# EAGLE design TempSensorCircuit_v2 (EAGLE 9.2.1)

## Sheet 1 of 2
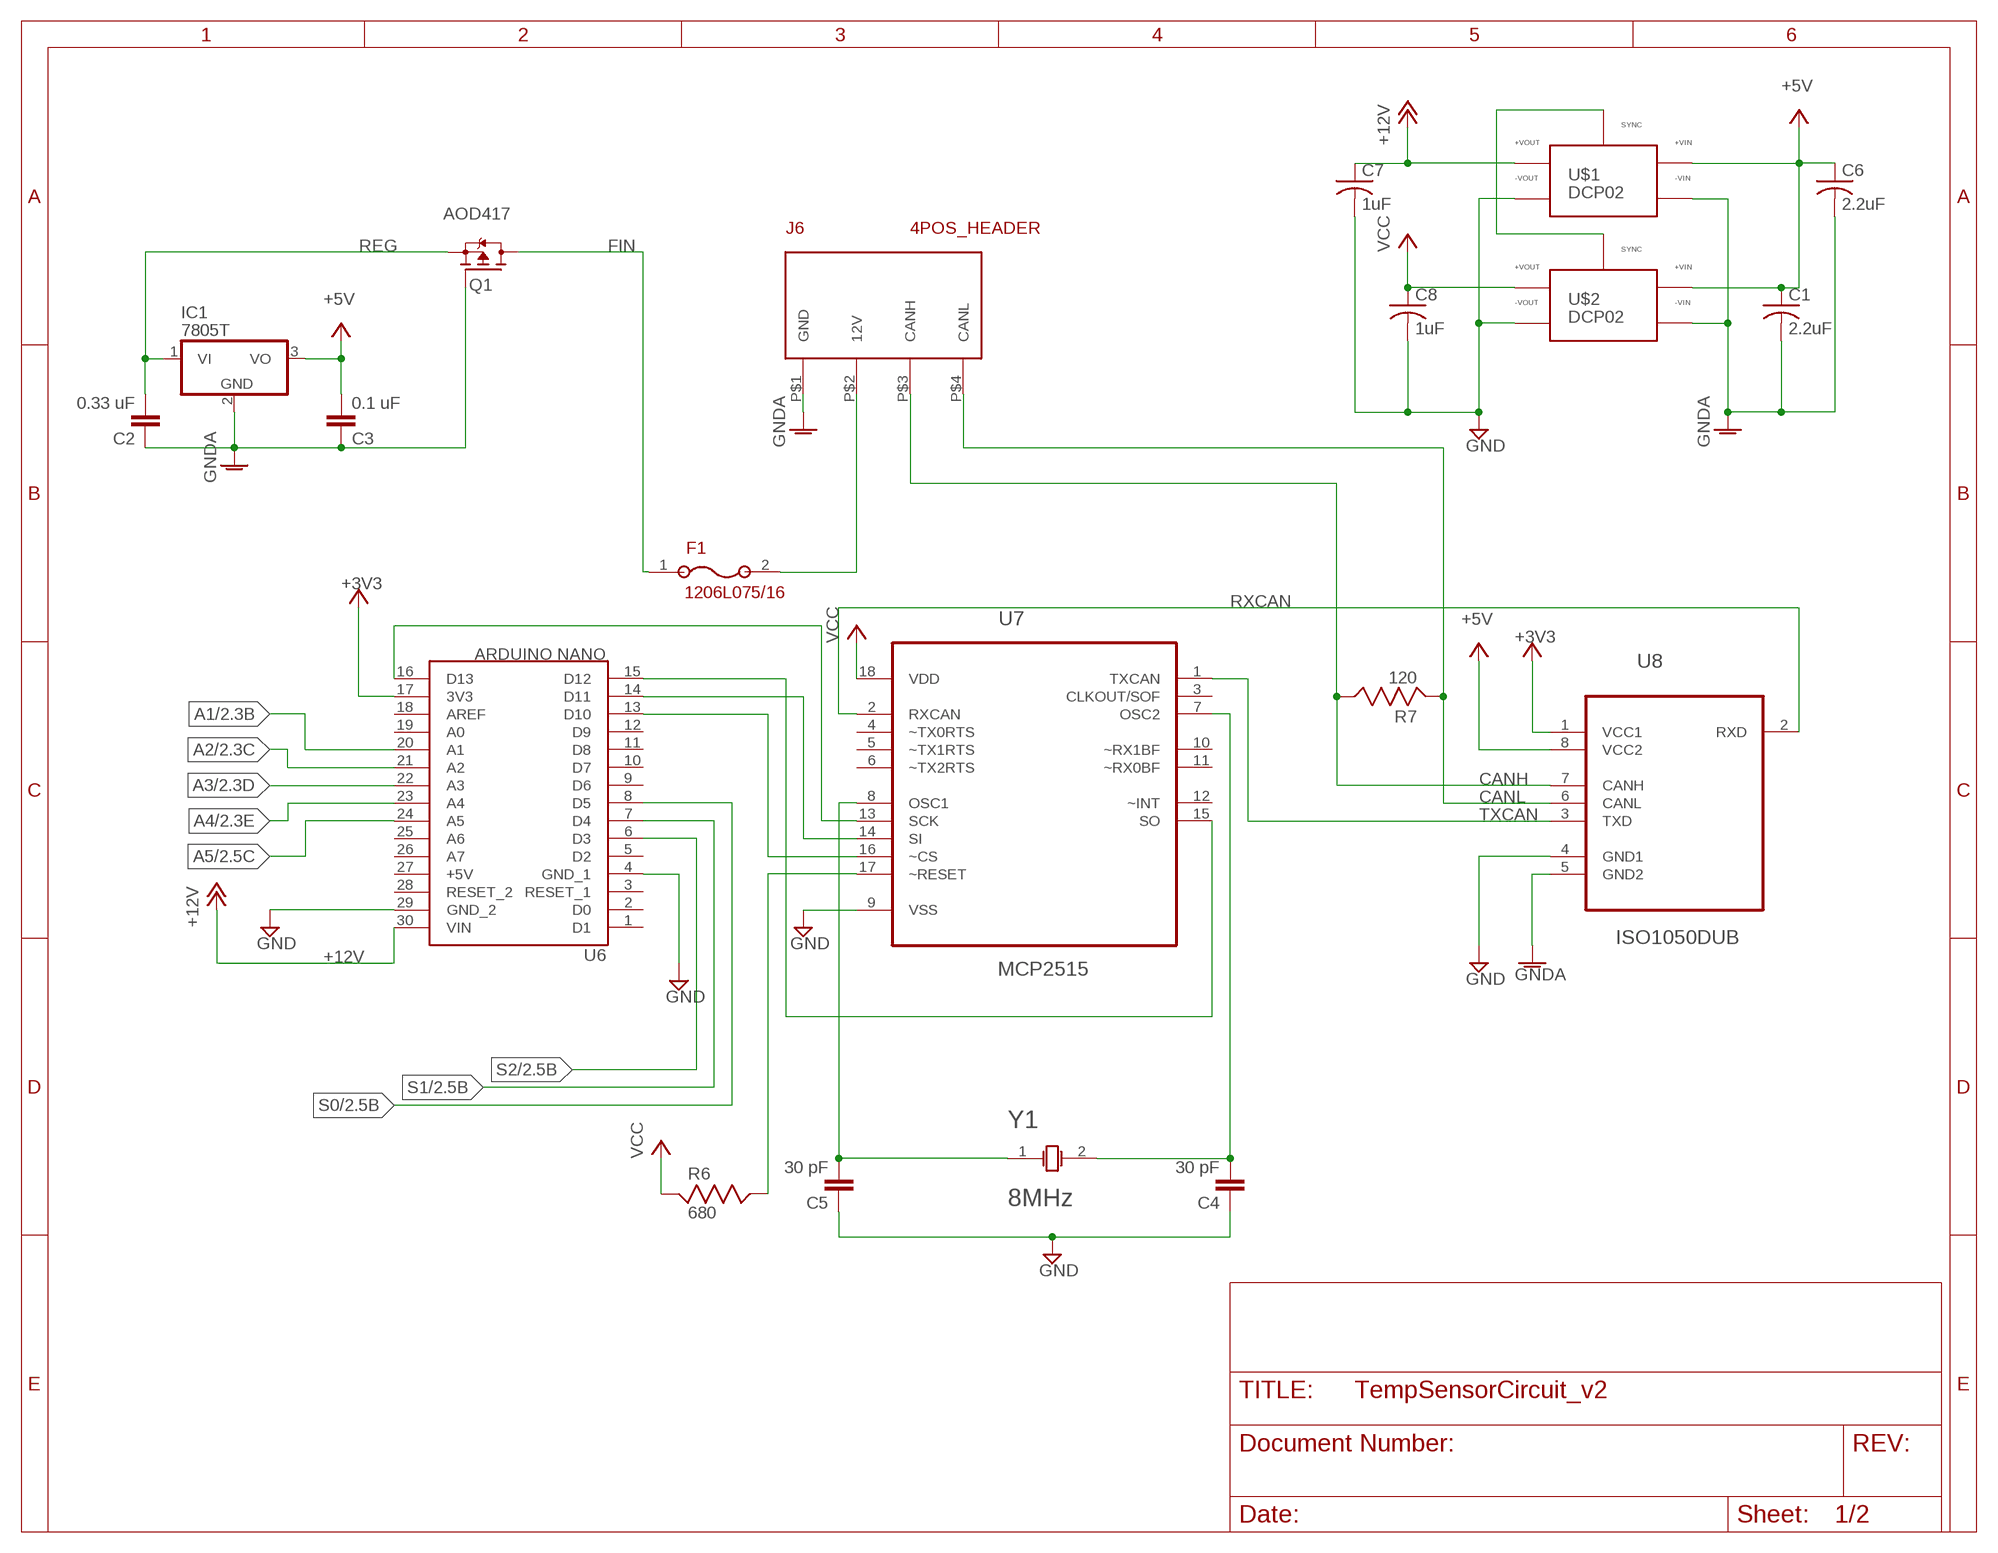
[diagram p0: schematic, sheet 1]

### Parts
C1  2.2uF  C-USC0805  [C0805]
C2  0.33 uF  C5/2.5  [C5B2.5]
C3  0.1 uF  C5/2.5  [C5B2.5]
C4  30 pF  C5/2.5  [C5B2.5]
C5  30 pF  C5/2.5  [C5B2.5]
C6  2.2uF  C-USC0805  [C0805]
C7  1uF  C-USC0805  [C0805]
C8  1uF  C-USC0805  [C0805]
F1  1206L075/16  [1206L075/16]
IC1  7805T  [TO220H]
J6  4POS_HEADER  [4POS_HEADER]
Q1  AOD417  FDD4141TO252  [TO252]
R6  680  RC0805FR-0751K1L  [RESC2012X60]
R7  120  RC0805FR-0751K1L  [RESC2012X60]
U6  ARDUINO NANO  NANO  [NANO]
U7  MCP2515  MCP2515-I/P  [DIP254P762X432-18]
U8  ISO1050DUB  [SOP254P1040X485-8N]
U$1  DCP02  [DIL14]
U$2  DCP02  [DIL14]
Y1  8MHz  HC49/SLF  [XTAL_HC49P488W43L1135T465H360]

### Nets
+3V3: U6.17(3V3) U8.1(VCC1)
+5V: C1.1 C3.2 C6.1 IC1.3(VO) U8.8(VCC2) U$1.1(+VIN) U$2.1(+VIN)
+12V: C7.1 U6.30(VIN) U$1.6(+VOUT)
A1: U6.20(A1) ; also sheet 2
A2: U6.21(A2) ; also sheet 2
A3: U6.22(A3) ; also sheet 2
A4: U6.23(A4) ; also sheet 2
A5: U6.24(A5) ; also sheet 2
CANH: J6.P$3(CANH) R7.2 U8.7(CANH)
CANL: J6.P$4(CANL) R7.1 U8.6(CANL)
FIN: F1.1 Q1.3(D)
GND: C4.1 C5.1 C7.2 C8.2 U6.4(GND_1) U6.29(GND_2) U7.9(VSS) U8.4(GND1) U$1.5(-VOUT) U$2.5(-VOUT) ; also sheet 2
GNDA: C1.2 C2.1 C3.1 C6.2 IC1.2(GND) J6.P$1(GND) Q1.1(G) U8.5(GND2) U$1.2(-VIN) U$2.2(-VIN)
N$1: R6.2 U7.17(~RESET)
N$3: U6.16(D13) U7.13(SCK)
N$7: U6.14(D11) U7.14(SI)
N$8: U6.15(D12) U7.15(SO)
N$9: U6.13(D10) U7.16(~CS)
N$10: U$1.14(SYNC) U$2.14(SYNC)
N$18: F1.2 J6.P$2(12V)
OSC_N [DiffPair]: C5.2 U7.8(OSC1) Y1.1
OSC_P [DiffPair]: C4.2 U7.7(OSC2) Y1.2
REG: C2.2 IC1.1(VI) Q1.2(S)
RXCAN: U7.2(RXCAN) U8.2(RXD)
S0: U6.8(D5) ; also sheet 2
S1: U6.7(D4) ; also sheet 2
S2: U6.6(D3) ; also sheet 2
TXCAN: U7.1(TXCAN) U8.3(TXD)
VCC: C8.1 R6.1 U7.18(VDD) U$2.6(+VOUT) ; also sheet 2
Unconnected: U6.1(D1) U6.2(D0) U6.3(RESET_1) U6.5(D2) U6.9(D6) U6.10(D7) U6.11(D8) U6.12(D9) U6.18(AREF) U6.19(A0) U6.25(A6) U6.26(A7) U6.28(RESET_2) U7.3(CLKOUT/SOF) U7.4(~TX0RTS) U7.5(~TX1RTS) U7.6(~TX2RTS) U7.10(~RX1BF) U7.11(~RX0BF) U7.12(~INT)

## Sheet 2 of 2
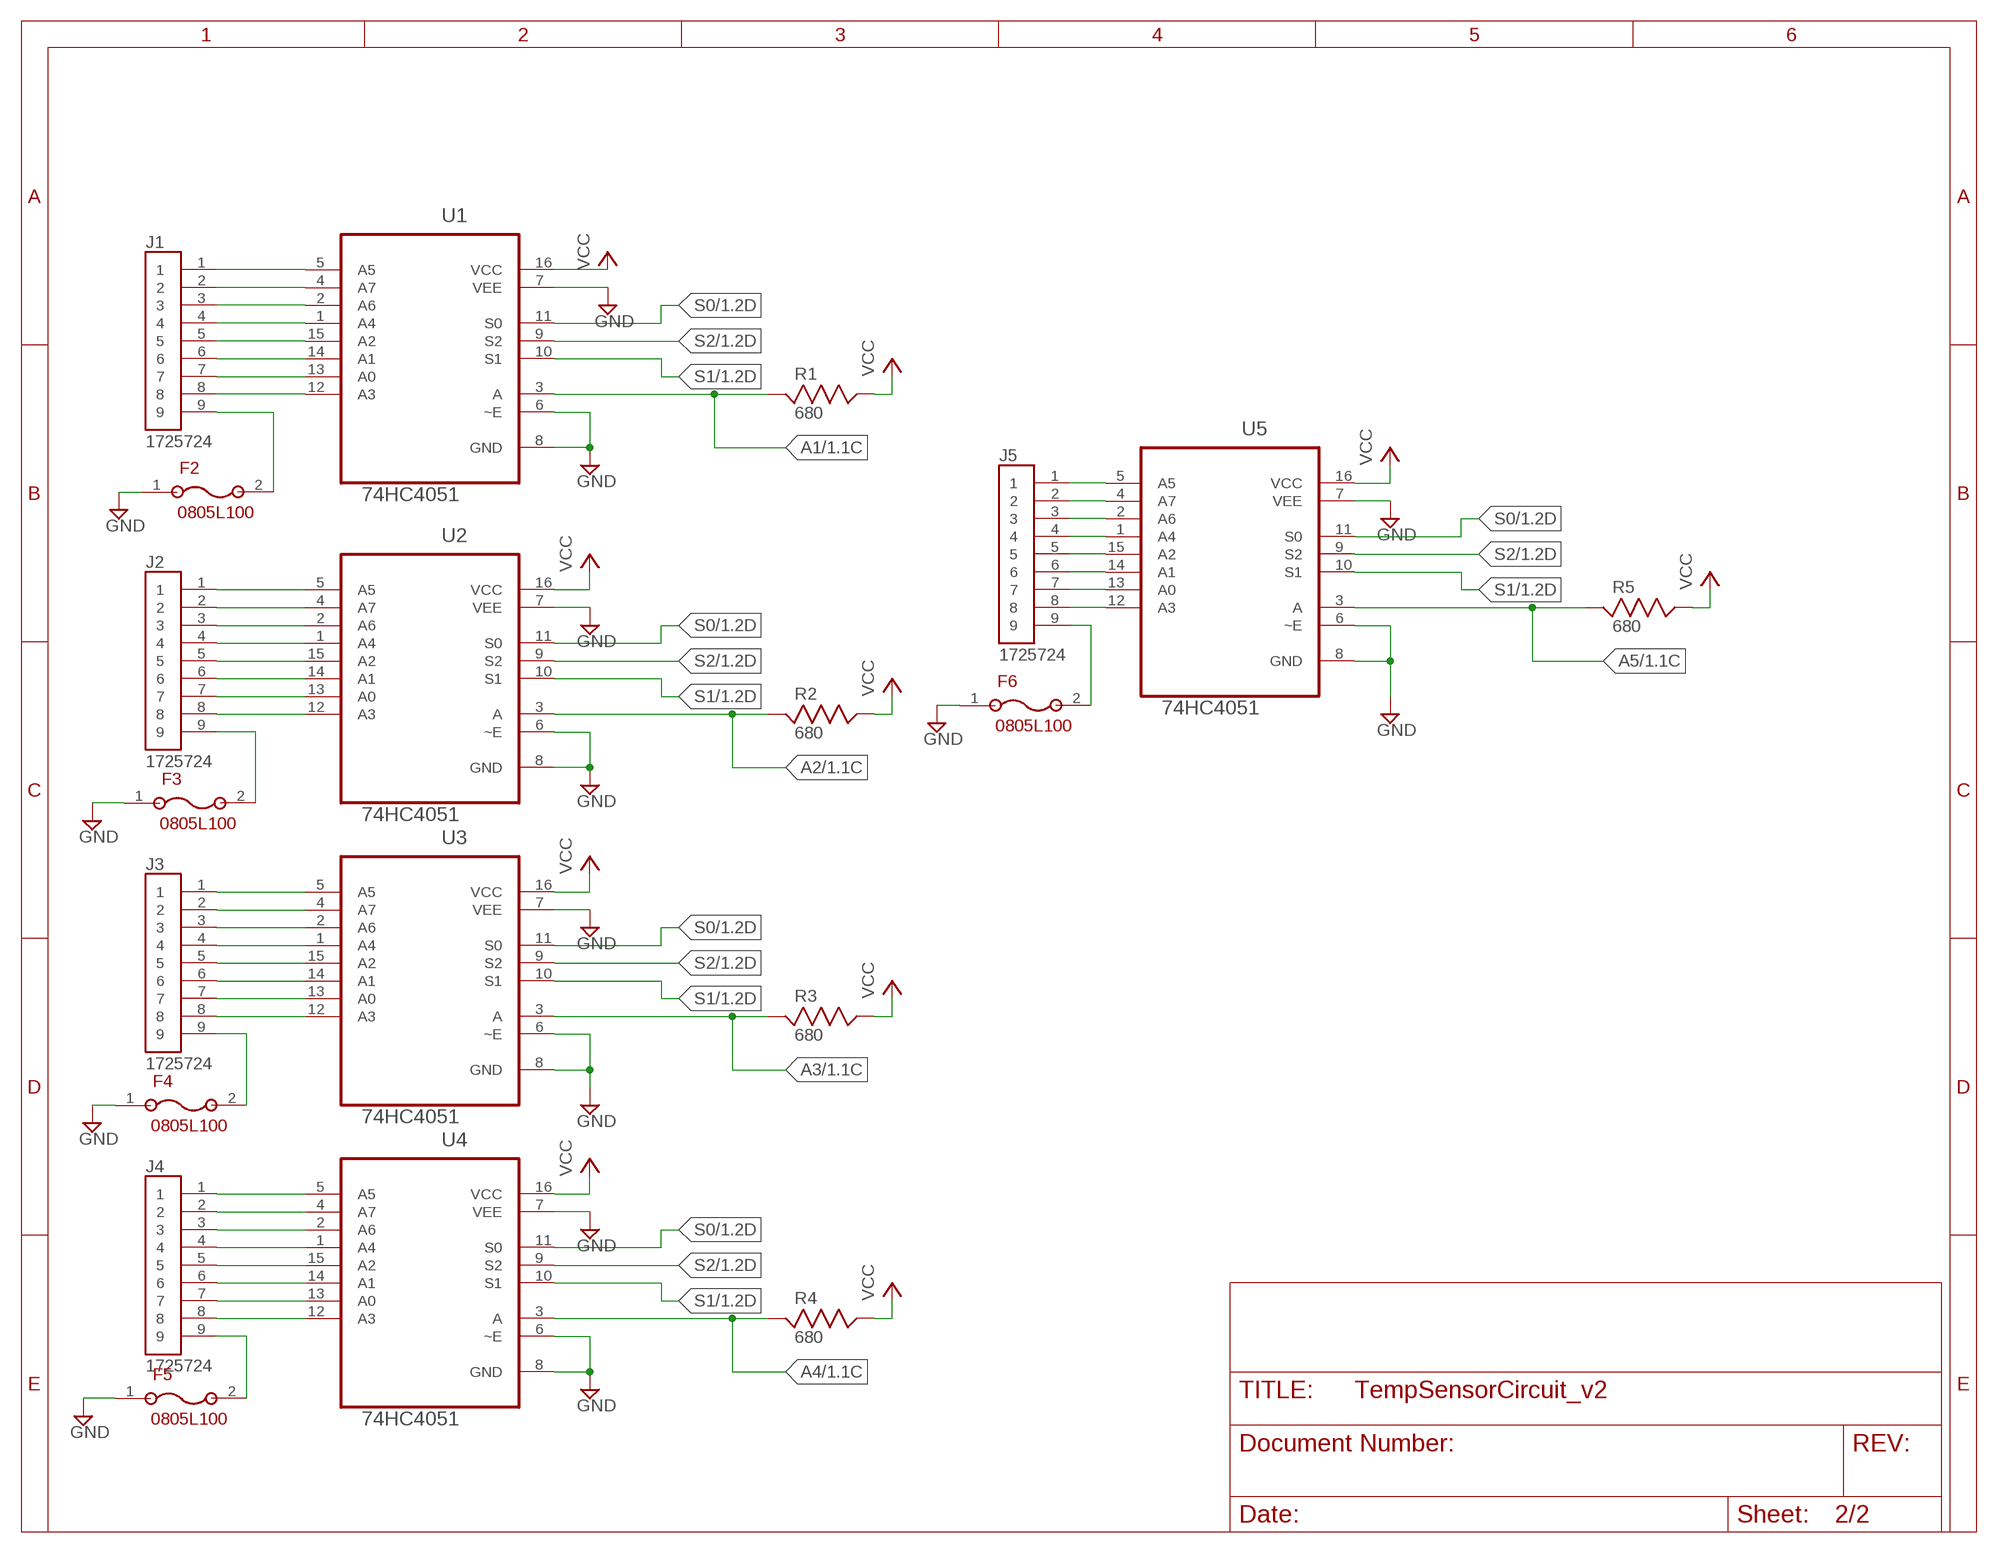
[diagram p1: schematic, sheet 2]

### Parts
F2  0805L100  [2012]
F3  0805L100  [2012]
F4  0805L100  [2012]
F5  0805L100  [2012]
F6  0805L100  [2012]
J1  1725724  [HDRV9W90P254_9X1_2332X620X850]
J2  1725724  [HDRV9W90P254_9X1_2332X620X850]
J3  1725724  [HDRV9W90P254_9X1_2332X620X850]
J4  1725724  [HDRV9W90P254_9X1_2332X620X850]
J5  1725724  [HDRV9W90P254_9X1_2332X620X850]
R1  680  RC0805FR-0751K1L  [RESC2012X60]
R2  680  RC0805FR-0751K1L  [RESC2012X60]
R3  680  RC0805FR-0751K1L  [RESC2012X60]
R4  680  RC0805FR-0751K1L  [RESC2012X60]
R5  680  RC0805FR-0751K1L  [RESC2012X60]
U1  74HC4051  CD74HC4051E  [DIP254P762X508-16]
U2  74HC4051  CD74HC4051E  [DIP254P762X508-16]
U3  74HC4051  CD74HC4051E  [DIP254P762X508-16]
U4  74HC4051  CD74HC4051E  [DIP254P762X508-16]
U5  74HC4051  CD74HC4051E  [DIP254P762X508-16]

### Nets
A1: R1.1 U1.3(A) ; also sheet 1
A2: R2.1 U2.3(A) ; also sheet 1
A3: R3.1 U3.3(A) ; also sheet 1
A4: R4.1 U4.3(A) ; also sheet 1
A5: R5.1 U5.3(A) ; also sheet 1
GND: F2.1 F3.1 F4.1 F5.1 F6.1 U1.6(~E) U1.7(VEE) U1.8(GND) U2.6(~E) U2.7(VEE) U2.8(GND) U3.6(~E) U3.7(VEE) U3.8(GND) U4.6(~E) U4.7(VEE) U4.8(GND) U5.6(~E) U5.7(VEE) U5.8(GND) ; also sheet 1
N$2: J3.1 U3.5(A5)
N$4: J3.2 U3.4(A7)
N$5: J1.8 U1.12(A3)
N$6: J3.3 U3.2(A6)
N$13: J3.4 U3.1(A4)
N$14: J3.5 U3.15(A2)
N$15: J3.6 U3.14(A1)
N$17: J3.7 U3.13(A0)
N$19: J1.7 U1.13(A0)
N$20: J1.6 U1.14(A1)
N$21: J1.5 U1.15(A2)
N$22: J1.4 U1.1(A4)
N$23: J1.3 U1.2(A6)
N$25: J1.2 U1.4(A7)
N$26: J1.1 U1.5(A5)
N$27: J3.8 U3.12(A3)
N$28: J2.1 U2.5(A5)
N$29: J2.2 U2.4(A7)
N$30: J2.3 U2.2(A6)
N$31: J2.4 U2.1(A4)
N$32: J2.5 U2.15(A2)
N$33: J2.6 U2.14(A1)
N$34: J2.7 U2.13(A0)
N$35: J2.8 U2.12(A3)
N$36: J4.1 U4.5(A5)
N$37: J4.2 U4.4(A7)
N$38: J4.3 U4.2(A6)
N$39: J4.4 U4.1(A4)
N$40: J4.5 U4.15(A2)
N$41: J4.6 U4.14(A1)
N$42: J4.7 U4.13(A0)
N$43: J4.8 U4.12(A3)
N$45: F2.2 J1.9
N$46: F5.2 J4.9
N$47: F4.2 J3.9
N$48: F3.2 J2.9
N$49: F6.2 J5.9
N$51: J5.1 U5.5(A5)
N$52: J5.2 U5.4(A7)
N$53: J5.3 U5.2(A6)
N$54: J5.4 U5.1(A4)
N$55: J5.5 U5.15(A2)
N$56: J5.6 U5.14(A1)
N$57: J5.7 U5.13(A0)
N$58: J5.8 U5.12(A3)
S0: U1.11(S0) U2.11(S0) U3.11(S0) U4.11(S0) U5.11(S0) ; also sheet 1
S1: U1.10(S1) U2.10(S1) U3.10(S1) U4.10(S1) U5.10(S1) ; also sheet 1
S2: U1.9(S2) U2.9(S2) U3.9(S2) U4.9(S2) U5.9(S2) ; also sheet 1
VCC: R1.2 R2.2 R3.2 R4.2 R5.2 U1.16(VCC) U2.16(VCC) U3.16(VCC) U4.16(VCC) U5.16(VCC) ; also sheet 1

## Power pins joined to a net without a drawn wire
+5V: U6.27(+5V)

## Library data of the parts
C1 C6-C8 = rcl:C-US: CAPACITOR, American symbol; SPICEPREFIX: C
C2-C5 = capacitor-wima:C: CAPACITOR naming: grid - package width
F1 = 1206L:1206L075/16
F2-F6 = 0805L:0805L100
IC1 = linear:78*: Positive VOLTAGE REGULATOR Source: http://cache.national.com/ds/LM/LM78L05.pdf http://www.fairchildsemi.com/ds/LM/LM7805.pdf
J1-J5 = 1725724:1725724: Conn; Term Blk; PCB; 9; 2.54mm; Front; Screw; 26-20 AWG; 6A; 63V; Solder; 1.5kV; DESCRIPTION: Conn; Term Blk; PCB; 9; 2.54mm; Front; Screw; 26-20 AWG; 6A; 63V; Solder; 1.5kV; DIGI-KEY_PART_NUMBER: 277-1280-ND; DIGI-KEY_PURCHASE_URL: https://www.digikey.ca/product-detail/en/phoenix-contact/1725724/277-1280-ND/267469?utm_source=snapeda&utm_medium=aggregator&utm_campaign=symbol; MF: Phoenix Contact; MP: 1725724; PACKAGE: None
J6 = 4Pos_Header:4POS_HEADER
Q1 = AOD417:FDD4141: P-Channel PowerTrench® MOSFET Source: FDD4141.pdf; AVAILABILITY: Unavailable; DESCRIPTION: Transistor: P-MOSFET; unipolar; -40V; -50A; 69W; DPAK; MF: ON Semiconductor; MP: FDD4141; PACKAGE: TO-252-3 Fairchild Semiconductor; PRICE: None
R1-R7 = RC0805FR-0751K1L:RC0805FR-0751K1L: RC Series 0805 0.125 W 2 kOhms 5% ±100 ppm/°C SMT Thick Film Chip Resistor; AVAILABILITY: Unavailable; DESCRIPTION: Res Thick Film 2.0 x 1.2 mm 51.1K Ohm 1% 0.125W_1/8W_ 100ppm/ C Molded SMD Paper T/R; MF: Yageo; MP: RC0805FR-0751K1L; PACKAGE: 0805 Yageo; PRICE: None
U1-U5 = CD74HC4051E:CD74HC4051E: HIGH-SPEED CMOS LOGIC ANALOG MULTIPLEXERS/DEMULTIPLEXERS; AVAILABILITY: Unavailable; DESCRIPTION: High Speed CMOS 8-Channel Analog Multiplexer/Demultiplexer 16-PDIP -55 to 125; MF: Texas Instruments; MP: CD74HC4051E; PACKAGE: PDIP-16 Texas Instruments; PRICE: None
U6 = ArduinoNano:NANO: MICRO, ARDUINO NANO 3.0, MINI-B USB, ATmega328, 0.1"DIP, ICSP HDR; AVAILABILITY: Unavailable; DESCRIPTION: MICRO, ARDUINO NANO 3.0, MINI-B USB, ATmega328, 0.1DIP, ICSP HDR; MF: Arduino; MP: A000005; PACKAGE: None; PRICE: None
U7 = MCP2515-I_P:MCP2515-I/P: Stand-Alone CAN Controller; AVAILABILITY: Unavailable; DESCRIPTION: MCP2515 Series 5.5 V 1 Mb/s Stand Alone SPI Interface CAN Controller - PDIP-18; MF: Microchip; MP: MCP2515-I/P; PACKAGE: DIP-18 Microchip; PRICE: None
U8 = ISO1050DUB:ISO1050DUB: ISOLATED CAN TRANSCEIVER; AVAILABILITY: Unavailable; DESCRIPTION: Isolated 5-V CAN Transceivers 8-SOP -55 to 105; MF: Texas Instruments; MP: ISO1050DUB; PACKAGE: SOP-8 Texas Instruments; PRICE: None
U$1 U$2 = ISO1050DUB:DCP02
Y1 = XTAL_HC49P488W43L1135T465H360:HC49/SLF

## Net classes
0 default: width 0.5 mm, clearance 0.2 mm
1 DiffPair: width 0.305 mm, clearance 0.2 mm

## Board
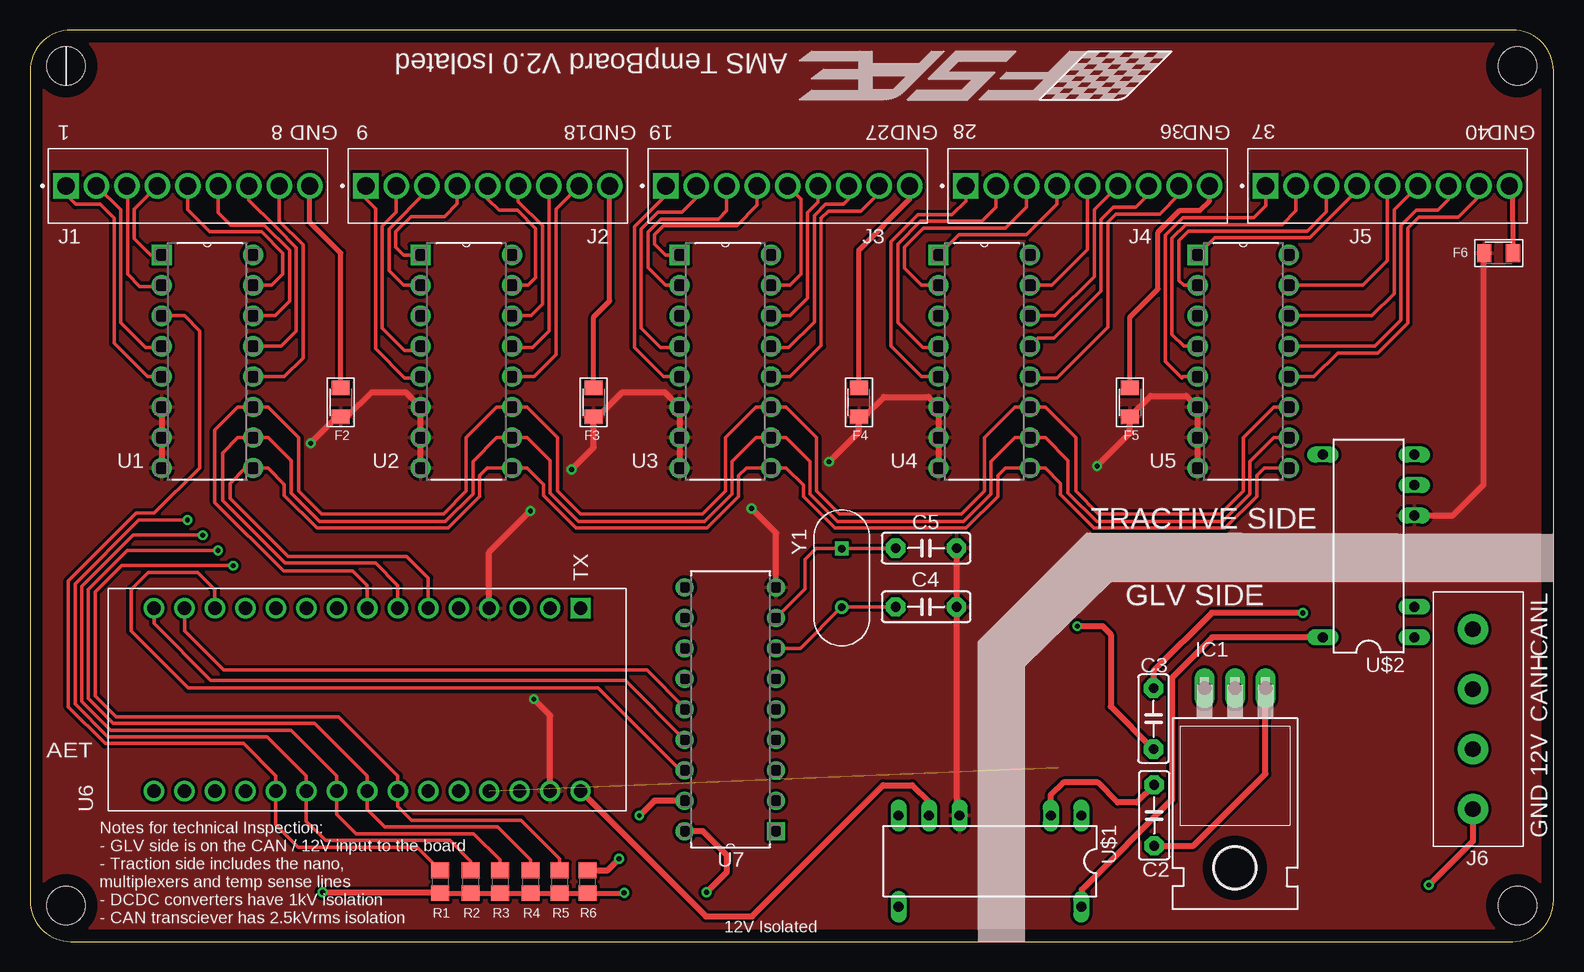
[diagram p2: board, top side]
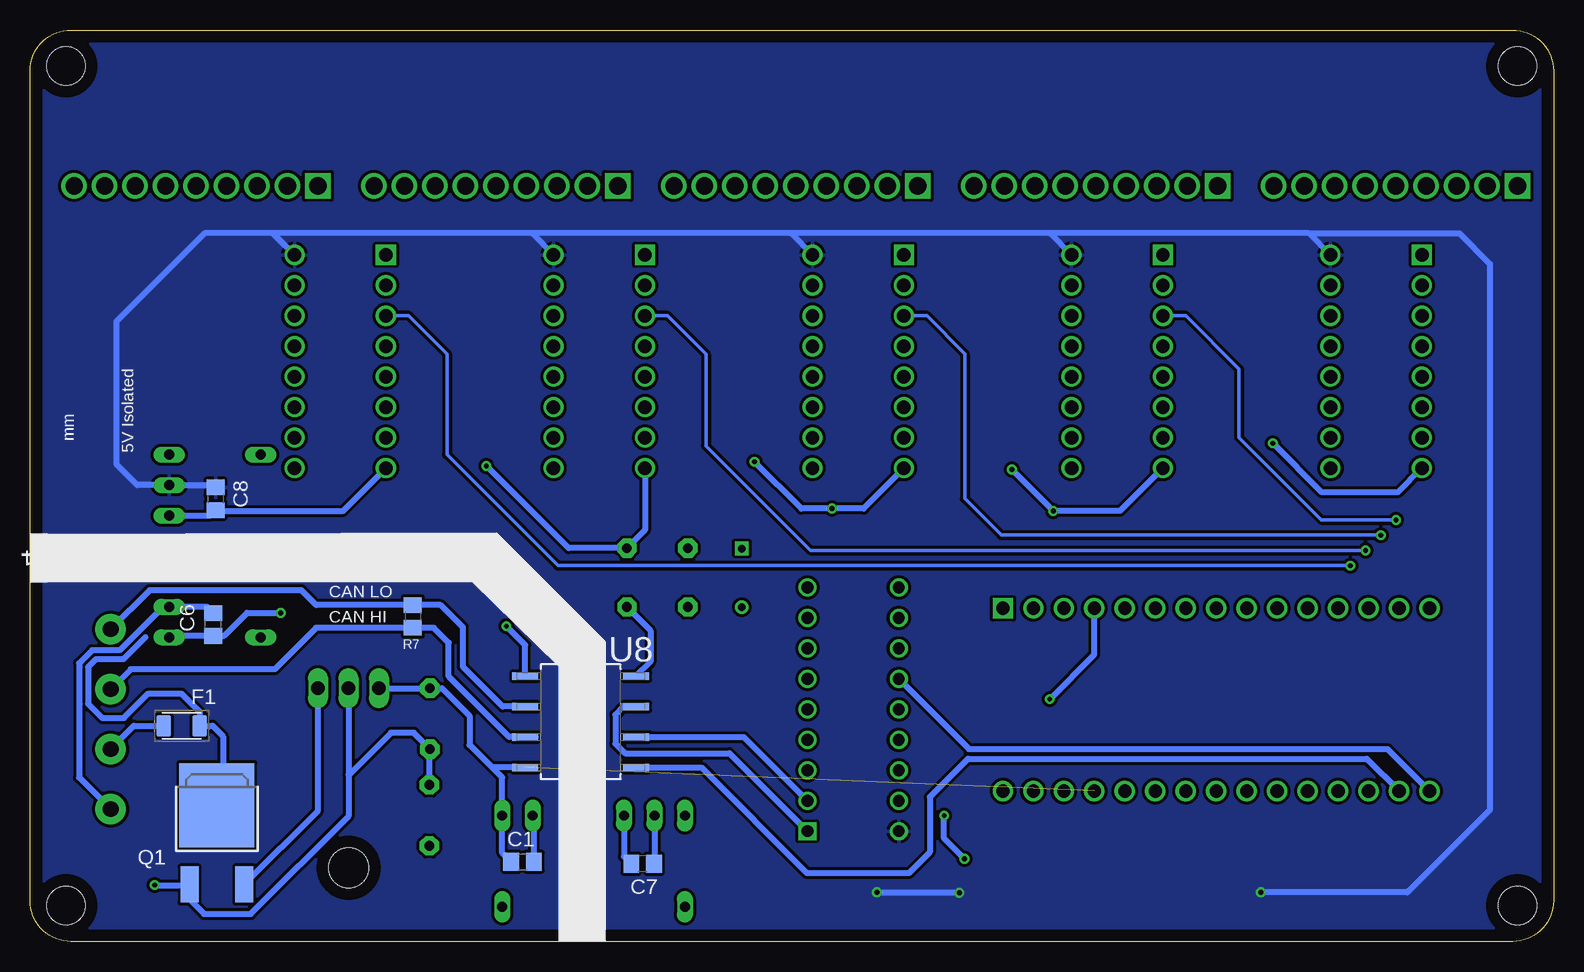
[diagram p3: board, bottom side, seen from below]

Size 127 x 76 mm. Coordinates in mm from the lower left corner, seen from the top.
Outline: 0,72.59 0,3.41 arc90 3.41,0 123.59,0 arc90 127,3.41 127,72.59 arc90 123.59,76 3.41,76 arc90 0,72.59
Copper layers (1*16): Top 0.035mm / dielectric 2mm / Bottom 0.035mm
Design rules "default *": minimum track width 6mil, minimum drill 0.4mm, track to track 10mil, track to pad 10mil, pad to pad 10mil, via to via 10mil, smd to smd 6mil, copper to edge 40mil, drill to drill 6mil, minimum pad ring 10mil, minimum via ring 8mil, stop-mask expansion 4mil, vias tented up to drill 0mil, thermal gap 10mil
Holes 3.17 mm at 3,73 124,73 124,3 3,3

### Footprints (pad centres in the part's own frame; a part is rotated, then mirrored left to right if it is on the bottom)
C0805 = smd 1.3 x 1.5: 1 -0.95,0; 2 0.95,0
C5B2.5 = drill 0.813 pad 1.6 octagon: 1 -2.54,0; 2 2.54,0
1206L075/16 = smd 1.2 x 1.82: 1 -1.505,0; 2 1.505,0
2012 = smd 1.2 x 1.5: 1 -1.2,0; 2 1.2,0
TO220H = drill 1.118 long: 1 -2.54,-10.16; 2 0,-10.16; 3 2.54,-10.16 | hole 3.302: 0,4.826
HDRV9W90P254_9X1_2332X620X850 = drill 1.42 square: 1 0,0 | drill 1.42: 2 2.54,0; 3 5.08,0; 4 7.62,0; 5 10.16,0; 6 12.7,0; 7 15.24,0; 8 17.78,0; 9 20.32,0
4POS_HEADER = drill 1.3 pad 2.54: P$1 -7.5,0.45; P$2 -2.5,0.45; P$3 2.5,0.45; P$4 7.5,0.45
TO252 = smd 1.5 x 3: 1 -2.286,-6.6; 2 2.28,-6.6 | smd 6.25 x 7: 3 0,0
RESC2012X60 = smd 1.3 x 1.5: 1 -0.95,0; 2 0.95,0
DIP254P762X508-16 = drill 1.118 square: 1 -7.62,17.78 | drill 1.118: 2 -7.62,15.24; 3 -7.62,12.7; 4 -7.62,10.16; 5 -7.62,7.62; 6 -7.62,5.08; 7 -7.62,2.54; 8 -7.62,0; 9 0,0; 10 0,2.54; 11 0,5.08; 12 0,7.62; 13 0,10.16; 14 0,12.7; 15 0,15.24; 16 0,17.78
NANO = drill 1.1 pad 1.7 square: 1 -7.62,17.78 | drill 1.1 pad 1.7: 2 -7.62,15.24; 3 -7.62,12.7; 4 -7.62,10.16; 5 -7.62,7.62; 6 -7.62,5.08; 7 -7.62,2.54; 8 -7.62,0; 9 -7.62,-2.54; 10 -7.62,-5.08; 11 -7.62,-7.62; 12 -7.62,-10.16; 13 -7.62,-12.7; 14 -7.62,-15.24; 15 -7.62,-17.78; 16 7.62,-17.78; 17 7.62,-15.24; 18 7.62,-12.7; 19 7.62,-10.16; 20 7.62,-7.62; 21 7.62,-5.08; 22 7.62,-2.54; 23 7.62,0; 24 7.62,2.54; 25 7.62,5.08; 26 7.62,7.62; 27 7.62,10.16; 28 7.62,12.7; 29 7.62,15.24; 30 7.62,17.78
DIP254P762X432-18 = drill 0.991 square: 1 -7.62,20.32 | drill 0.991: 2 -7.62,17.78; 3 -7.62,15.24; 4 -7.62,12.7; 5 -7.62,10.16; 6 -7.62,7.62; 7 -7.62,5.08; 8 -7.62,2.54; 9 -7.62,0; 10 0,0; 11 0,2.54; 12 0,5.08; 13 0,7.62; 14 0,10.16; 15 0,12.7; 16 0,15.24; 17 0,17.78; 18 0,20.32
SOP254P1040X485-8N = smd 2.159 x 0.61: 1 -4.623,3.81; 2 -4.623,1.27; 3 -4.623,-1.27; 4 -4.623,-3.81; 5 4.623,-3.81; 6 4.623,-1.27; 7 4.623,1.27; 8 4.623,3.81
DIL14 = drill 0.813 long: 1 -7.62,-3.81; 2 -5.08,-3.81; 5 2.54,-3.81; 6 5.08,-3.81; 7 7.62,-3.81; 8 7.62,3.81; 14 -7.62,3.81
XTAL_HC49P488W43L1135T465H360 = drill 0.63 pad 1.03 square: 1 -2.44,0 | drill 0.63 pad 1.03: 2 2.44,0

### Placement (x,y rotation side)
C1  85.95,6.65 0 bottom
C2  93.71,10.52 270 top
C3  93.66,18.58 90 top
C4  74.7,27.9 180 top
C5  74.7,32.8 180 top
C6  111.73,26.43 90 bottom
C7  75.93,6.49 180 bottom
C8  111.54,36.92 270 bottom
F1  114.35,17.98 180 bottom
F2  25.91,44.96 90 top
F3  46.99,44.96 90 top
F4  69.09,44.96 90 top
F5  91.69,44.96 90 top
F6  122.43,57.4 0 top
IC1  100.45,10.97 180 top
J1  3,63 0 top
J2  28,63 0 top
J3  53,63 0 top
J4  78,63 0 top
J5  103,63 0 top
J6  120.72,18.55 90 top
Q1  111.42,11.36 0 bottom
R1  34.2,4.98 270 top
R2  36.73,4.98 270 top
R3  39.17,4.98 270 top
R4  41.72,4.98 270 top
R5  44.16,4.98 270 top
R6  46.49,4.98 90 top
R7  95.09,27.1 270 bottom
U1  18.59,39.47 0 top
U2  40.18,39.47 0 top
U3  61.77,39.47 0 top
U4  83.36,39.47 0 top
U5  104.95,39.47 0 top
U6  28.11,20.16 270 top
U7  54.58,29.52 180 top
U8  81.1,18.32 180 bottom
U$1  80.02,6.7 180 top
U$2  111.58,32.98 90 top
Y1  67.66,30.32 270 top

### Tracks (layer width: path | path; a pad name or v marks a point on that pad's centre or on a via)
+3V3
  Bottom 0.5: U6.17 15.58,15.25 48.8,15.25 52,12.05 52,7.45 53.75,5.7 62.23,5.7 71.04,14.51 U8.1
+5V  (via drill 0.4)  (1 unrouted)
  Top 0.5: v106.1,27.4 98.51,27.4 93.66,22.55 C3.2
  Bottom 0.5: IC1.3 97.9,21.12 C3.2 92.66,21.12 90.36,18.82 90.36,16.39 88.48,14.51 | U8.8 88.48,14.51 | C1.1 87.64,7.39 U$1.1 87.64,13.67 88.48,14.51 | U$2.1 115.27,25.48 C6.1 110.82,25.48 108.9,27.4 v106.1,27.4
+12V
  Top 0.5: U6.30 56.34,2.1 60.19,2.1 71.12,13.03 73.54,13.03 74.94,11.63 U$1.6
  Bottom 0.5: U$1.6 74.94,6.53 C7.1
A1
  Top 0.305: U1.3 12.88,52.17 14.14,50.9 14.14,39.5 10.36,35.71 8.85,35.71 3.19,30.06 3.19,19.57 6.26,16.51 17.8,16.51 20.5,13.81 U6.20 20.5,9.73 22.35,7.87 32.27,7.87 34.2,5.95 R1.1
A2  (via drill 0.4)
  Top 0.305: v13.13,35.15 9.08,35.15 3.75,29.82 3.75,19.8 6.49,17.07 19.78,17.07 23.04,13.81 U6.21 23.04,10.04 24.64,8.43 35,8.43 36.73,6.7 R2.1
  Bottom 0.305: U2.3 30.66,52.17 26.21,47.72 26.21,42.01 19.35,35.15 v13.13,35.15
A3  (via drill 0.4)
  Top 0.305: v14.4,33.88 8.6,33.88 4.31,29.59 4.31,20.03 6.72,17.62 21.77,17.62 25.57,13.81 U6.22 25.57,10.6 27.18,8.99 36.98,8.99 39.17,6.8 R3.1
  Bottom 0.305: U3.3 52.24,52.17 49.07,48.99 49.07,36.93 46.02,33.88 v14.4,33.88
A4  (via drill 0.4)
  Top 0.305: v15.67,32.61 8.12,32.61 4.87,29.36 4.87,20.26 6.95,18.18 23.75,18.18 28.11,13.81 U6.23 28.11,11 29.57,9.55 38.96,9.55 41.72,6.8 R4.1
  Bottom 0.305: U4.3 73.83,52.17 70.66,48.99 70.66,41.33 61.94,32.61 v15.67,32.61
A5  (via drill 0.4)
  Top 0.305: v16.94,31.34 7.64,31.34 5.43,29.13 5.43,20.49 7.18,18.74 25.73,18.74 30.66,13.81 U6.24 30.66,11.26 31.8,10.11 40.95,10.11 44.16,6.9 R5.1
  Bottom 0.305: U5.3 95.42,52.17 92.25,48.99 92.25,40.6 82.99,31.34 v16.94,31.34
CANH
  Bottom 0.5: 84.85,17.05 U8.7 87.05,17.05 92.1,22.1 92.1,24.9 93.35,26.15 R7.2 103.15,26.15 106.6,22.7 118.62,22.7 J6.P$3
CANL
  Bottom 0.5: U8.6 87.59,19.59 90.9,22.9 90.9,26.2 92.75,28.05 R7.1 103.13,28.05 104.36,29.29 117.03,29.29 J6.P$4
FIN
  Bottom 0.5: 109.84,11.36 Q1.3 110.9,11.88 110.9,17.1 111.78,17.98 F1.1 112.85,19.14 114.39,20.68 117.13,20.68 119.18,18.63 120.96,18.63 122.15,19.82 122.15,22.89 121.51,23.52 119.22,23.52 117.39,25.36
GND  (via drill 0.4)
  Top 0.5: U1.6 U1.7 U1.8 | U2.8 U2.7 U2.6 31.31,45.8 28.5,45.8 26.46,43.76 F2.1 25.61,43.76 v23.4,41.55 | U4.8 U4.7 U4.6 74.89,45.4 71.18,45.4 69.54,43.76 F4.1 69.09,42.49 v66.6,40 | U3.8 U3.7 U3.6 52.9,45.8 49.38,45.8 47.34,43.76 F3.1 46.99,41.19 v45.15,39.35 | U5.8 U5.7 U5.6 96.38,45.5 93.44,45.5 F5.1 91.69,42.39 v88.95,39.65 | F6.1 121.17,57.35 121.17,38.1 118.59,35.52 U$2.5 | U7.9 62.2,34.05 v60.15,36.1 | U6.29 43.35,18.84 v42,20.2 | U6.4 38.27,32.48 v41.7,35.9 | C5.1 C4.1 77.24,10.75 U$1.5
  Bottom 0.5: U1.8 12.99,37.45 19.3,37.45 v23.4,41.55 | U2.8 36.13,35.9 v41.7,35.9 v45.15,39.35 | U3.8 57.52,36.1 v60.15,36.1 62.7,36.1 v66.6,40 | U4.8 75.74,34.3 C5.1 82.1,32.8 v88.95,39.65 | v42,20.2 38.27,23.93 U6.4 | U8.4 75.28,23.33 75.28,25.93 C4.1 | U5.8 100.94,35.86 111.43,35.86 C8.2 111.99,35.52 U$2.5 | U$1.5 77.48,7.09 C7.2
  pour Top: -6.4,81.08 137.77,81.08 137.77,31.7 137.77,-7.62 43.89,-7.62 -6.4,-7.62
GNDA  (via drill 0.4)
  Top 0.5: v87.3,26.3 89.4,26.3 90.1,25.6 90.1,19.6 C3.1 | J6.P$1 120.27,8.37 v116.6,4.7 | C2.1 92.25,11.6 90.66,11.6 89,13.26 86.13,13.26 85.08,12.21 85.08,10.53 U$1.2
  Bottom 0.2: C6.2 112.25,27.9 | U$2.2 115.91,27.9
  Bottom 0.5: IC1.2 100.45,13.9 | 100.45,13.9 100.45,10.45 108.6,2.3 112.5,2.3 113.7,3.5 Q1.1 113.77,4.7 v116.6,4.7 | C2.1 93.71,15.99 C3.1 95.02,17.4 96.9,17.4 100.4,13.9 100.45,13.9 | J6.P$1 122.9,13.68 122.9,23.2 121.82,24.28 119.54,24.28 115.91,27.9 | U8.5 85.72,24.72 v87.3,26.3 | C1.2 85,10.41 U$1.2 | C6.2 112.11,27.76 | 112.25,27.9 U$2.2
N$1  (via drill 0.4)
  Top 0.5: U7.17 52.05,11.74 v50.8,10.5 | R6.2 48.13,5.93 v49.1,6.9
  Bottom 0.5: v49.1,6.9 50.8,8.6 v50.8,10.5
N$2
  Top 0.305: U3.5 52.83,47.09 50.39,49.53 50.39,59.62 53,62.23 J3.1
N$3
  Bottom 0.5: U7.13 48.73,16.05 13.85,16.05 U6.16
N$4
  Top 0.305: U3.4 54.05,49.53 52.58,49.53 50.95,51.16 50.95,59.39 52.37,60.81 54.36,60.81 55.54,61.99 J3.2
N$5
  Top 0.305: U1.12 21.18,47.09 22.76,48.67 22.76,58.1 20.78,60.08 J1.8
N$6
  Top 0.305: U3.2 52.99,54.71 51.51,56.19 51.51,59.16 52.6,60.25 57.4,60.25 58.08,60.92 J3.3
N$7
  Top 0.305: U6.14 12.88,25.88 16.13,22.63 51.44,22.63 54.58,19.49 U7.14
N$8
  Top 0.305: U6.15 10.34,26.52 15.08,21.77 49.64,21.77 U7.15
N$9
  Top 0.305: U6.13 15.41,29.36 13.99,30.78 9.85,30.78 8.43,29.36 8.43,25.88 13.18,21.14 47.37,21.14 54.22,14.29 U7.16
N$10
  Top 0.5: U$2.14 98.56,25.36 95.2,22 95.2,11.85 87.67,4.32 87.67,2.92
N$13
  Top 0.305: U3.1 52.99,57.25 52.07,58.17 52.07,58.93 52.83,59.69 58.93,59.69 60.62,61.38 J3.4
N$14
  Top 0.305: U3.15 63.34,54.71 64.26,55.63 64.26,61.9 J3.5
N$15
  Top 0.305: U3.14 63.34,52.17 64.82,53.65 64.82,60.76 65.7,61.64 J3.6
N$17
  Top 0.305: U3.13 61.87,49.53 63.25,49.53 65.38,51.66 65.38,60.52 66.32,61.47 67.82,61.47 68.24,61.89 J3.7
N$18
  Bottom 0.5: J6.P$2 118.34,17.98 F1.2
N$19
  Top 0.305: U1.13 20.93,49.63 22.2,50.9 22.2,57.15 22.2,57.87 20.6,59.46 20.48,59.59 18.24,61.83 J1.7
N$20
  Top 0.305: U1.14 20.42,52.17 21.64,53.39 21.64,57.63 19.54,59.74 16.71,59.74 15.7,60.75 J1.6
N$21
  Top 0.305: U1.15 20.16,54.71 21.08,55.63 21.08,57.4 19.3,59.18 14.99,59.18 13.16,61.01 J1.5
N$22
  Top 0.305: U1.1 10.06,57.25 8.69,58.62 8.69,61.07 J1.4
N$23
  Top 0.305: U1.2 10.87,54.61 9.14,54.61 8.13,55.63 8.13,62.95 J1.3
N$25
  Top 0.305: U1.4 10.87,49.53 9.65,49.53 7.57,51.61 7.57,61.01 5.58,63 J1.2
N$26
  Top 0.305: U1.5 9.81,47.09 7.01,49.89 7.01,60.3 5.84,61.47 3.81,61.47 3,62.28 J1.1
N$27
  Top 0.305: U3.12 63.34,47.09 65.94,49.68 65.94,60.29 66.55,60.91 69.29,60.91 70.78,62.4 J3.8
N$28
  Top 0.305: U2.5 32.46,46.99 31.24,46.99 28.8,49.43 28.8,61.11 28,61.92 J2.1
N$29
  Top 0.305: U2.4 32.21,49.28 31.24,49.28 29.36,51.16 29.36,59.65 30.54,60.82 J2.2
N$30
  Top 0.305: U2.2 31.14,54.71 29.92,55.93 29.92,59.41 33.08,62.57 J2.3
N$31
  Top 0.305: U2.1 31.14,57.25 30.48,57.91 30.48,59.18 31.75,60.45 34.54,60.45 35.62,61.53 J2.4
N$32
  Top 0.305: U2.15 41.5,54.71 42.16,55.37 42.16,59.44 40.64,60.96 39.12,60.96 38.16,61.92 J2.5
N$33
  Top 0.305: U2.14 41.76,52.17 42.72,53.14 42.72,59.67 40.7,61.69 J2.6
N$34
  Top 0.305: U2.13 40.28,49.53 41.91,49.53 43.28,50.9 43.28,62.96 J2.7
N$35
  Top 0.305: U2.12 42.01,47.09 43.84,48.92 43.84,61.06 J2.8
N$36
  Top 0.305: U4.5 74.32,47.09 71.78,49.63 71.78,58.38 74.01,60.6 76.86,60.6 78,61.74 J4.1
N$37
  Top 0.305: U4.4 75.64,49.53 74.42,49.53 72.34,51.61 72.34,58.14 74.24,60.05 79.35,60.05 80.54,61.24 J4.2
N$38
  Top 0.305: U4.2 74.32,54.71 73.36,55.68 72.9,56.13 72.9,57.91 74.47,59.49 81.33,59.49 83.08,61.24 J4.3
N$39
  Top 0.305: U4.1 77.42,58.93 83.06,58.93 85.62,61.49 J4.4
N$40
  Top 0.305: U4.15 85.19,54.71 88.16,57.68 J4.5
N$41
  Top 0.305: U4.14 85.44,52.17 88.72,55.45 88.72,61.02 J4.6
N$42
  Top 0.305: U4.13 84.02,50.29 85.34,50.29 89.28,54.23 89.28,60.2 90.29,61.21 92.2,61.21 93.24,62.25 J4.7
N$43
  Top 0.305: U4.12 83.46,46.99 85.6,46.99 89.05,50.44 89.84,51.23 89.84,56.13 89.84,59.97 90.53,60.66 94.18,60.66 95.78,62.25 J4.8
N$45
  Top 0.406: F2.2 25.91,57.4 23.32,59.99 J1.9
N$46
  Top 0.406: F5.2 91.69,52.07 94.03,54.41 94.03,59.13 95.86,60.96 97.54,60.96 98.32,61.74 J4.9
N$47
  Top 0.406: F4.2 69.09,57.66 73.32,61.89 J3.9
N$48
  Top 0.406: F3.2 46.99,52.07 48.32,53.4 J2.9
N$49
  Top 0.406: F6.2 123.61,62.71 J5.9
N$51
  Top 0.305: U5.5 96.11,47.09 96.01,46.99 94.64,48.36 94.64,58.88 96.11,60.35 102.01,60.35 103,61.34 J5.1
N$52
  Top 0.305: U5.4 96.17,49.63 95.2,50.6 95.2,58.65 96.34,59.79 104.39,59.79 105.54,60.94 J5.2
N$53
  Top 0.305: U5.2 96.17,54.71 95.76,55.12 95.76,58.42 96.57,59.23 106.48,59.23 108.08,60.84 J5.3
N$54
  Top 0.305: U5.1 98.75,58.67 106.71,58.67 110.62,62.59 J5.4
N$55
  Top 0.305: U5.15 111.1,54.71 113.16,56.77 J5.5
N$56
  Top 0.305: U5.14 111.86,52.17 113.72,54.03 113.72,61.02 J5.6
N$57
  Top 0.305: U5.13 112.11,49.63 114.28,51.79 114.28,59.69 115.55,60.96 117.35,60.96 118.24,61.85 J5.7
N$58
  Top 0.305: U5.12 107.03,47.09 109.01,49.07 112.34,49.07 114.84,51.56 114.84,59.46 115.78,60.4 119.08,60.4 120.78,62.11 J5.8
OSC_N
  Top 0.305: C5.2 72.12,32.77 Y1.1 65.52,32.77 64.6,31.85 64.6,29.38 U7.8
OSC_P
  Top 0.305: C4.2 72.14,27.89 Y1.2 64.22,24.45 U7.7
REG
  Top 0.5: C2.2 96.98,7.98 102.99,13.99 IC1.1
  Bottom 0.5: Q1.2 102.99,10.91 IC1.1
RXCAN
  Bottom 0.5: U8.2 67.51,17.05 U7.2
S0
  Top 0.305: U5.11 103.68,44.55 101.14,42.01 101.14,37.56 99.23,35.66 89.08,35.66 87.17,37.56 87.17,42.01 84.63,44.55 U4.11 82.09,44.55 79.55,42.01 79.55,37.56 77.64,35.66 67.48,35.66 65.58,37.56 65.58,42.01 63.04,44.55 U3.11 60.5,44.55 57.96,42.01 57.96,37.56 56.05,35.66 45.9,35.66 43.99,37.56 43.99,42.01 41.45,44.55 U2.11 38.91,44.55 36.37,42.01 36.37,37.56 34.47,35.66 24.3,35.66 22.4,37.56 22.4,42.01 19.86,44.55 U1.11 17.32,44.55 15.41,42.64 15.41,36.62 21.12,30.91 26.89,30.91 28.11,29.69 U6.8
S1
  Top 0.305: U5.10 103.68,42.01 101.7,40.03 101.7,37.33 99.39,35.02 88.92,35.02 86.53,37.41 86.53,40.1 84.63,42.01 U4.10 82.09,42.01 80.11,40.03 80.11,37.33 77.8,35.02 67.33,35.02 65.02,37.33 65.02,40.03 63.04,42.01 U3.10 60.5,42.01 58.52,40.03 58.52,37.33 56.21,35.02 45.74,35.02 43.35,37.41 43.35,40.1 41.45,42.01 U2.10 38.91,42.01 36.93,40.03 36.93,37.33 34.62,35.02 24.15,35.02 21.77,37.41 21.77,40.1 19.86,42.01 U1.10 17.32,42.01 16.05,40.74 16.05,36.77 21.28,31.54 28.8,31.54 30.66,29.69 U6.7
S2
  Top 0.305: U5.9 102.89,39.47 102.26,38.83 102.26,37.1 99.62,34.47 88.69,34.47 85.9,37.25 85.9,38.2 84.63,39.47 U4.9 81.3,39.47 80.67,38.83 80.67,37.1 78.03,34.47 67.1,34.47 64.46,37.1 64.46,38.05 63.04,39.47 U3.9 59.71,39.47 59.08,38.83 59.08,37.1 56.44,34.47 45.51,34.47 42.8,37.18 42.8,38.12 41.45,39.47 U2.9 38.12,39.47 37.49,38.83 37.49,37.1 34.85,34.47 23.92,34.47 21.21,37.18 21.21,38.12 19.86,39.47 U1.9 17.95,39.47 16.68,38.2 16.68,36.93 21.51,32.1 31.41,32.1 33.2,30.32 U6.6
TXCAN
  Bottom 0.5: U8.3 77.51,19.59 78.2,18.9 78.2,16.5 77.4,15.7 68.7,15.7 U7.1
VCC  (via drill 0.4)
  Top 0.406: R1.2 R2.2 R3.2 R4.2 R5.2 R6.1 49.5,4.03 v49.53,4.06
  Top 0.5: v56.4,4.1 58.1,5.8 58.1,7.2 56.09,9.21 U7.18 | v24.4,4.1 34.13,4.1 R1.2
  Bottom 0.5: U1.16 20.39,59.05 | 20.39,59.05 41.98,59.05 | 41.98,59.05 63.57,59.05 | 63.57,59.05 85.16,59.05 | 85.16,59.05 106.75,59.05 | U2.16 41.98,59.05 | U3.16 63.57,59.05 | U4.16 85.16,59.05 | U5.16 106.75,59.05 | v49.53,4.06 56.36,4.06 v56.4,4.1 | 20.39,59.05 7.85,59.05 5.3,56.5 5.3,11 12.2,4.1 v24.4,4.1 | 106.75,59.05 112.45,59.05 119.8,51.7 119.8,39.8 118.06,38.06 U$2.6 111.73,38.06 C8.1
  pour Bottom: 11.89,79.55 133.2,79.55 133.2,-0.3 133.2,-4.57 -5.18,-4.57 -5.18,79.55

### Text on the board
tPlace: AMS TempBoard V2.0 Isolated | 1 | 8 | GND | 9 | 18 | GND | 19 | 27 | GND | 28 | 36 | GND | 37 | 40 | GND | TRACTIVE SIDE | GLV SIDE | CANL | CANH | AET | 12V | GND | Notes for technical Inspection: / - GLV side is on the CAN / 12V input to the board / - Traction side includes the nano, / multiplexers and temp sense lines / - DCDC converters have 1kV isolation / - CAN transciever has 2.5kVrms isolation | 12V Isolated
bPlace: 5V Isolated | mm | CAN LO | CAN HI